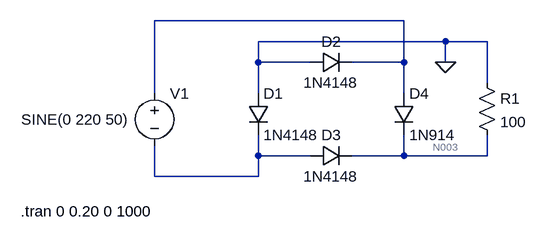
[diagram p0: schematic circuit_ver1.0.asc]
circuit_ver1.0.asc, the LTspice schematic file:
Version 4
SHEET 1 880 680
WIRE -720 64 -1104 64
WIRE -656 96 -944 96
WIRE -592 96 -656 96
WIRE -944 128 -944 96
WIRE -864 128 -944 128
WIRE -720 128 -720 64
WIRE -720 128 -800 128
WIRE -656 128 -656 96
WIRE -592 160 -592 96
WIRE -1104 176 -1104 64
WIRE -944 176 -944 128
WIRE -720 176 -720 128
WIRE -944 272 -944 240
WIRE -864 272 -944 272
WIRE -720 272 -720 240
WIRE -720 272 -800 272
WIRE -592 272 -592 240
WIRE -592 272 -720 272
WIRE -1104 304 -1104 256
WIRE -944 304 -944 272
WIRE -944 304 -1104 304
FLAG -656 128 0
SYMBOL voltage -1104 160 R0
WINDOW 3 -205 56 Left 2
WINDOW 123 0 0 Left 2
WINDOW 39 0 0 Left 2
SYMATTR InstName V1
SYMATTR Value SINE(0 220 50)
SYMBOL diode -960 176 R0
SYMATTR InstName D1
SYMATTR Value 1N4148
SYMBOL diode -864 144 R270
WINDOW 0 32 32 VTop 2
WINDOW 3 0 32 VBottom 2
SYMATTR InstName D2
SYMATTR Value 1N4148
SYMBOL diode -864 288 R270
WINDOW 0 32 32 VTop 2
WINDOW 3 0 32 VBottom 2
SYMATTR InstName D3
SYMATTR Value 1N4148
SYMBOL diode -736 176 R0
SYMATTR InstName D4
SYMATTR Value 1N914
SYMBOL res -608 144 R0
SYMATTR InstName R1
SYMATTR Value 100
TEXT -1310 358 Left 2 !.tran 0 0.20 0 1000

The netlist it stands for:
* circuit_ver1.0.asc
V1 N001 N002 SINE(0 220 50)
D1 0 N002 1N4148
D2 0 N001 1N4148
D3 N002 N003 1N4148
D4 N001 N003 1N914
R1 0 N003 100
.model D D
.lib standard.dio
.tran 0 0.20 0 1000
.backanno
.end

* Results of the author's LTspice run, read from the files saved beside the schematic
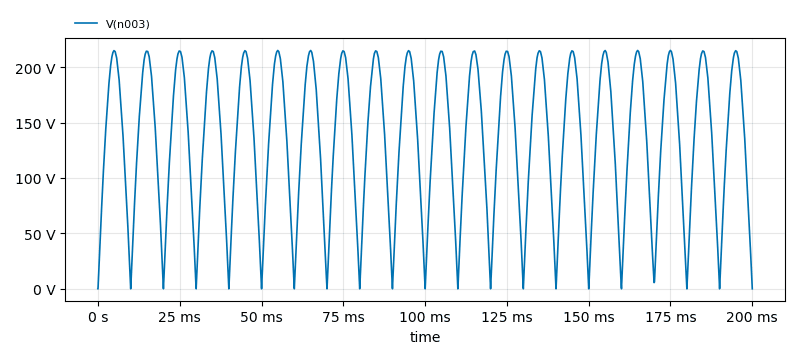
[diagram p1: Transient Analysis of circuit_ver1.0.asc, plotted from the saved traces]
* Transient Analysis, 1 run:
*   V(n003): min -741.5 µV, max 215.2 V, average 133.4 V, rms 150.2 V, last -741.5 µV